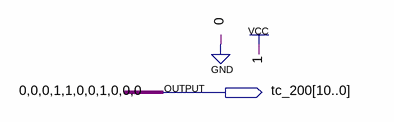
[diagram p0: schematic sheet]
// Quartus schematic tc_200.bdf as structural Verilog: 0 symbols, 1 pins
module tc_200 (
  output [10:0] tc_200
);


  assign tc_200 = 11'b00011001000;
endmodule
